# EAGLE design vc_reverb (EAGLE 7.4.0)

## Sheet 1 of 2
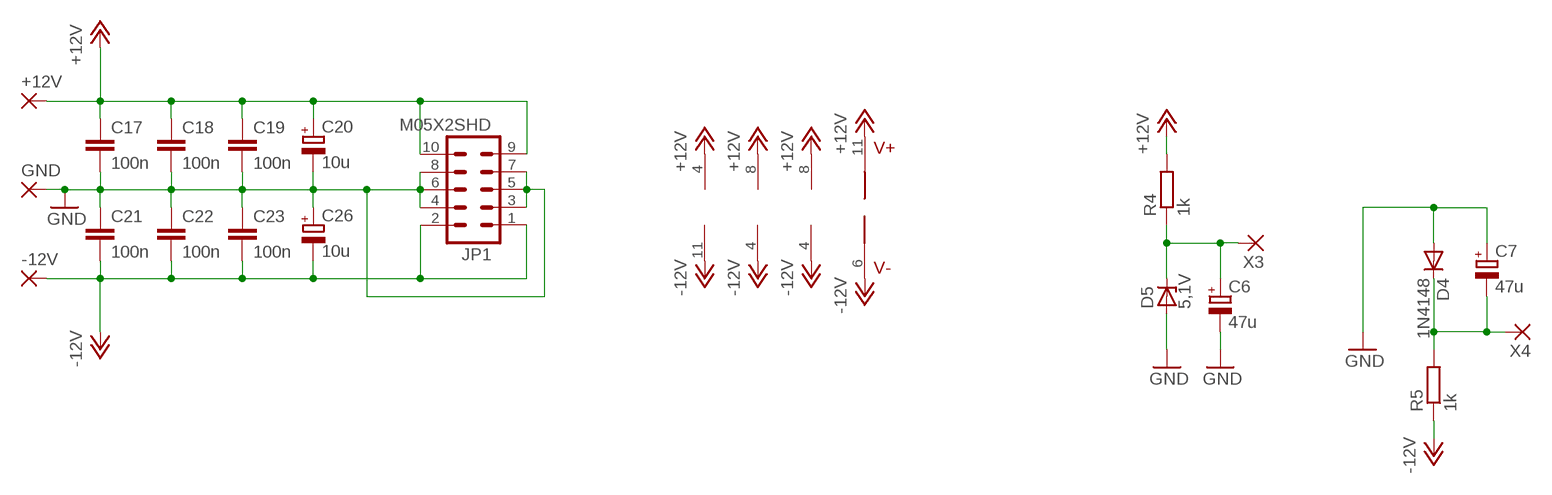
[diagram p0: schematic, sheet 1]

### Parts
+12V  2,54/1,0  [2,54/1,0]
-12V  2,54/1,0  [2,54/1,0]
C6  47u  CPOL-EUE2-5  [E2-5]
C7  47u  CPOL-EUE2-5  [E2-5]
C17  100n  C-EU025-025X050  [C025-025X050]
C18  100n  C-EU050-035X075  [C050-035X075]
C19  100n  C-EU025-025X050  [C025-025X050]
C20  10u  CPOL-EUE2-5  [E2-5]
C21  100n  C-EU025-025X050  [C025-025X050]
C22  100n  C-EU050-035X075  [C050-035X075]
C23  100n  C-EU025-025X050  [C025-025X050]
C26  10u  CPOL-EUE2-5  [E2-5]
D4  1N4148  1N4148DO35-7  [DO35-7]
D5  5,1V  ZENER-DIODEDO34-7  [DO34Z7]
GND  2,54/1,0  [2,54/1,0]
IC3  TL074P  [DIL14]
IC4  LM13700N  [DIL16]
IC5  TL072P  [DIL08]
IC6  TL072P  [DIL08]
JP1  M05X2SHD  [2X5-SHROUDED]
R4  1k  R-EU_0309/V  [0309V]
R5  1k  R-EU_0309/V  [0309V]
X3  2,54/1,0  [2,54/1,0]
X4  2,54/1,0  [2,54/1,0]

### Nets
+12V: +12V.1(P) C17.1 C18.1 C19.1 C20.+ IC3.4(P:V+) IC4.11(V+) IC5.8(P:V+) IC6.8(P:V+) JP1.9 JP1.10 R4.2 ; also sheet 2
-12V: -12V.1(P) C21.2 C22.2 C23.2 C26.- IC3.11(P:V-) IC4.6(V-) IC5.4(P:V-) IC6.4(P:V-) JP1.1 JP1.2 R5.1 ; also sheet 2
GND: C6.- C7.+ C17.2 C18.2 C19.2 C20.- C21.1 C22.1 C23.1 C26.+ D4.A D5.A GND.1(P) JP1.3 JP1.4 JP1.5 JP1.6 JP1.7 JP1.8 ; also sheet 2
N$46: C6.+ D5.C R4.1 X3.1(P)
N$47: C7.- D4.C R5.2 X4.1(P)

## Sheet 2 of 2
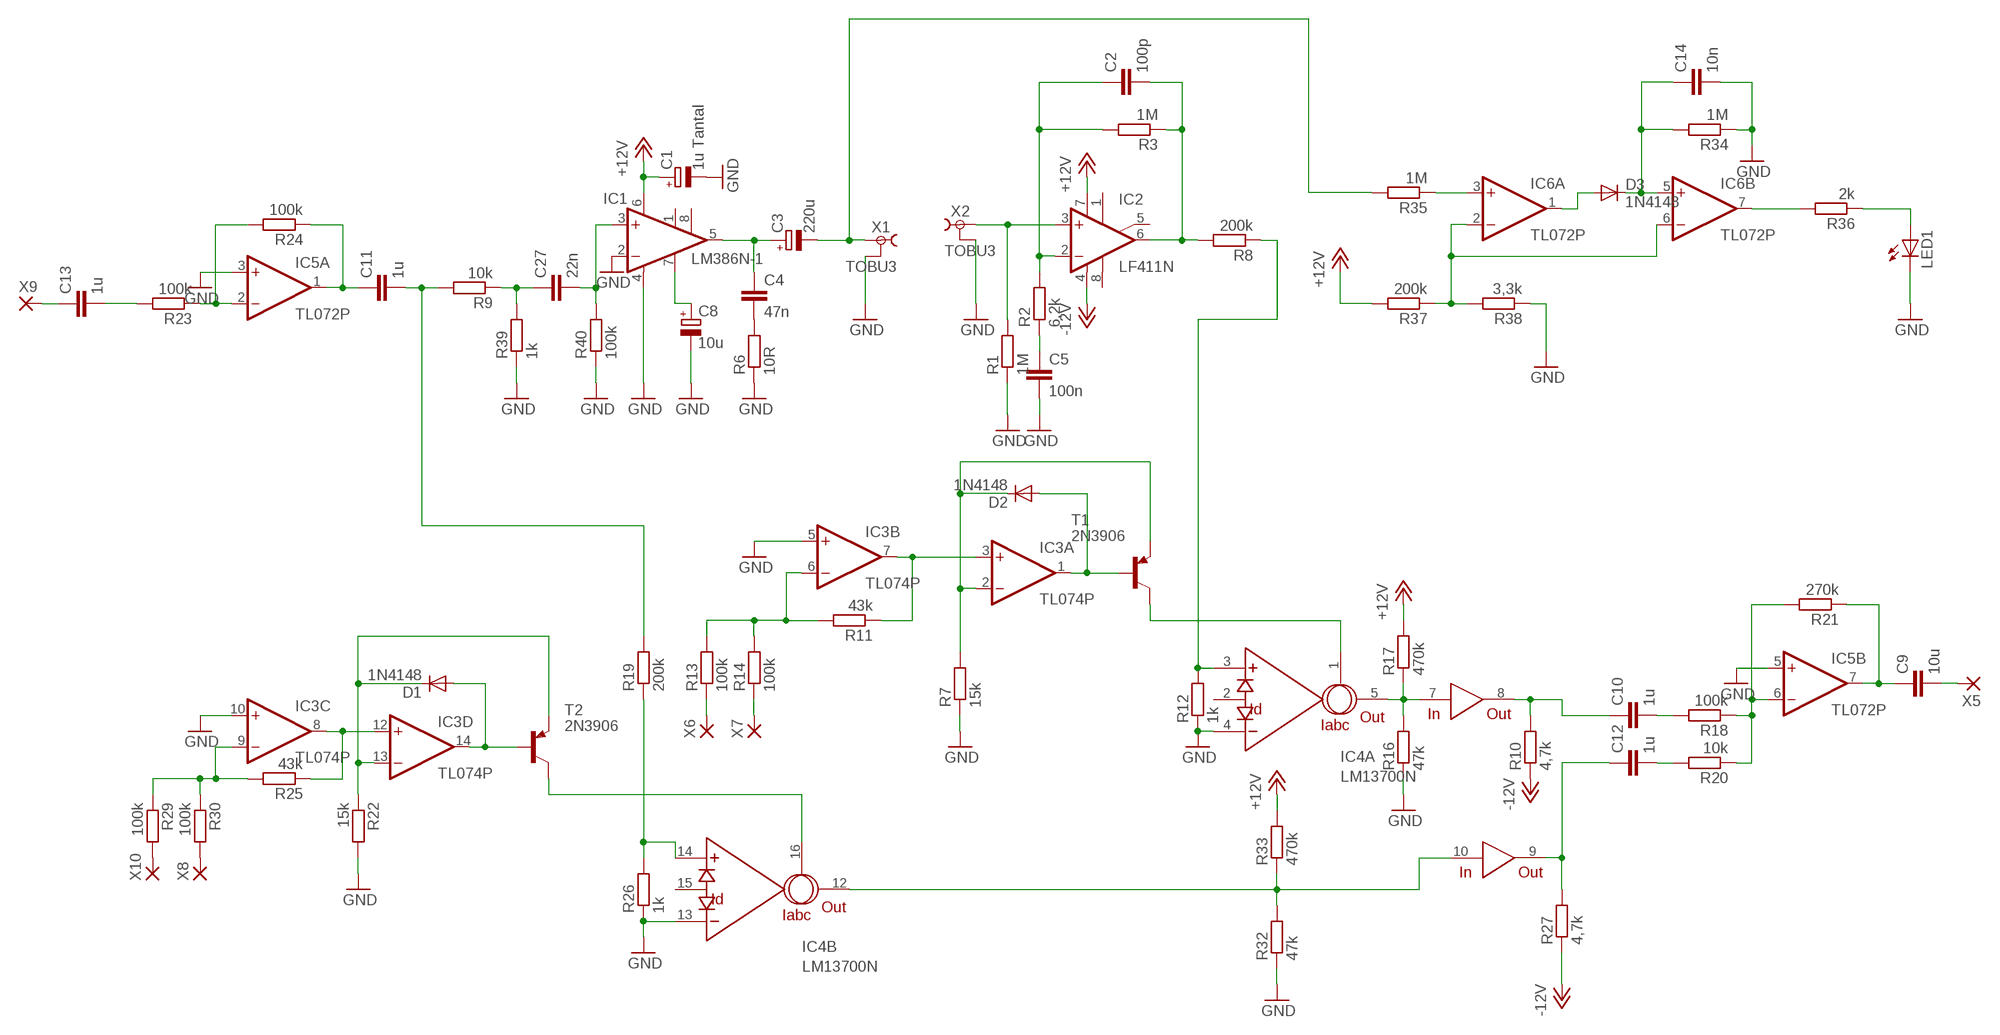
[diagram p1: schematic, sheet 2]

### Parts
C1  1u Tantal  CPOL-EUE2-5  [E2-5]
C2  100p  C-EU050-035X075  [C050-035X075]
C3  220u  CPOL-EUE3.5-8  [E3,5-8]
C4  47n  C-EU050-035X075  [C050-035X075]
C5  100n  C-EU050-035X075  [C050-035X075]
C8  10u  CPOL-EUE2-5  [E2-5]
C9  10u  C-EU050-075X075  [C050-075X075]
C10  1u  C-EU050-050X075  [C050-050X075]
C11  1u  C-EU050-050X075  [C050-050X075]
C12  1u  C-EU050-050X075  [C050-050X075]
C13  1u  C-EU050-050X075  [C050-050X075]
C14  10n  C-EU050-030X075  [C050-030X075]
C27  22n  C-EU050-035X075  [C050-035X075]
D1  1N4148  1N4148DO35-7  [DO35-7]
D2  1N4148  1N4148DO35-7  [DO35-7]
D3  1N4148  1N4148DO35-7  [DO35-7]
IC1  LM386N-1  [DIL08]
IC2  LF411N  [DIL08]
LED1  LED5MM  [LED5MM]
R1  1M  R-EU_0309/V  [0309V]
R2  6,2k  R-EU_0309/V  [0309V]
R3  1M  R-EU_0309/V  [0309V]
R6  10R  R-EU_0309/V  [0309V]
R7  15k  R-EU_0309/V  [0309V]
R8  200k  R-EU_0309/V  [0309V]
R9  10k  R-EU_0309/V  [0309V]
R10  4,7k  R-EU_0309/V  [0309V]
R11  43k  R-EU_0309/V  [0309V]
R12  1k  R-EU_0309/V  [0309V]
R13  100k  R-EU_0309/V  [0309V]
R14  100k  R-EU_0309/V  [0309V]
R16  47k  R-EU_0309/V  [0309V]
R17  470k  R-EU_0309/V  [0309V]
R18  100k  R-EU_0309/V  [0309V]
R19  200k  R-EU_0309/10  [0309/10]
R20  10k  R-EU_0309/V  [0309V]
R21  270k  R-EU_0309/V  [0309V]
R22  15k  R-EU_0309/V  [0309V]
R23  100k  R-EU_0309/V  [0309V]
R24  100k  R-EU_0309/V  [0309V]
R25  43k  R-EU_0309/V  [0309V]
R26  1k  R-EU_0309/V  [0309V]
R27  4,7k  R-EU_0309/V  [0309V]
R29  100k  R-EU_0309/V  [0309V]
R30  100k  R-EU_0309/V  [0309V]
R32  47k  R-EU_0309/V  [0309V]
R33  470k  R-EU_0309/V  [0309V]
R34  1M  R-EU_0309/V  [0309V]
R35  1M  R-EU_0309/V  [0309V]
R36  2k  R-EU_0309/V  [0309V]
R37  200k  R-EU_0309/V  [0309V]
R38  3,3k  R-EU_0309/V  [0309V]
R39  1k  R-EU_0309/V  [0309V]
R40  100k  R-EU_0309/V  [0309V]
T1  2N3906  2N3906-PNP-TO92-EBC  [TO92-EBC]
T2  2N3906  2N3906-PNP-TO92-EBC  [TO92-EBC]
X1  TOBU3  [TOBU3]
X2  TOBU3  [TOBU3]
X5  2,54/1,0  [2,54/1,0]
X6  2,54/1,0  [2,54/1,0]
X7  2,54/1,0  [2,54/1,0]
X8  2,54/1,0  [2,54/1,0]
X9  2,54/1,0  [2,54/1,0]
X10  2,54/1,0  [2,54/1,0]

### Nets
+12V: C1.+ IC1.6(VS) IC2.7(V+) R17.2 R33.2 R37.2 ; also sheet 1
-12V: IC2.4(V-) R10.1 R27.1 ; also sheet 1
GND: C1.- C5.2 C8.- C14.2 IC1.2(-IN) IC1.4(GND) IC3.5(B:+IN) IC3.10(C:+IN) IC4.4(A:-IN) IC4.13(B:-IN) IC5.3(A:+IN) IC5.5(B:+IN) LED1.K(C) R1.1 R6.1 R7.1 R12.1 R16.1 R22.2 R26.1 R32.1 R34.1 R38.1 R39.1 R40.1 X1.2 X1.2@1 X1.2@2 X2.2 X2.2@1 X2.2@2 ; also sheet 1
N$1: D3.A IC6.1(A:OUT)
N$2: C14.1 D3.C IC6.5(B:+IN) R34.2
N$3: IC6.7(B:OUT) R36.2
N$4: LED1.A R36.1
N$5: IC6.3(A:+IN) R35.1
N$6: C3.+ C4.1 IC1.5(OUT)
N$7: IC6.2(A:-IN) IC6.6(B:-IN) R37.1 R38.2
N$8: C8.+ IC1.7(BYPASS)
N$9: C4.2 R6.2
N$10: C27.2 IC1.3(+IN) R40.2
N$11: C27.1 R9.1 R39.2
N$12: IC2.3(+IN) R1.2 X2.1
N$13: C2.1 IC2.2(-IN) R2.2 R3.2
N$14: C5.1 R2.1
N$15: C2.2 IC2.6(OUT) R3.1 R8.2
N$16: IC5.2(A:-IN) R23.1 R24.2
N$17: C11.1 IC5.1(A:OUT) R24.1
N$18: C13.2 R23.2
N$19: C13.1 X9.1(P)
N$20: C11.2 R9.2 R19.2
N$21: C12.2 R20.2
N$22: C10.2 R18.2
N$23: IC5.6(B:-IN) R18.1 R20.1 R21.2
N$24: C9.1 IC5.7(B:OUT) R21.1
N$25: C9.2 X5.1(P)
N$26: C12.1 IC4.9(OUT) R27.2
N$27: C10.1 IC4.8(OUT) R10.2
N$28: IC4.5(A:OUT) IC4.7(IN) R16.2 R17.1
N$29: IC4.3(A:+IN) R8.1 R12.2
N$30: D2.A IC3.1(A:OUT) T1.B
N$31: IC4.10(IN) IC4.12(B:OUT) R32.2 R33.1
N$32: IC4.14(B:+IN) R19.1 R26.2
N$33: D2.C IC3.2(A:-IN) R7.2 T1.E
N$34: IC3.3(A:+IN) IC3.7(B:OUT) R11.1
N$35: IC3.6(B:-IN) R11.2 R13.2 R14.2
N$36: R14.1 X7.1(P)
N$37: R13.1 X6.1(P)
N$38: IC4.1(A:IABC) T1.C
N$39: D1.A IC3.14(D:OUT) T2.B
N$40: D1.C IC3.13(D:-IN) R22.1 T2.E
N$41: IC3.8(C:OUT) IC3.12(D:+IN) R25.1
N$42: IC3.9(C:-IN) R25.2 R29.1 R30.1
N$43: R30.2 X8.1(P)
N$44: R29.2 X10.1(P)
N$45: IC4.16(B:IABC) T2.C
OL: C3.- R35.2 X1.1
Unconnected: IC1.1(GAIN) IC1.8(GAIN) IC2.1(ON1) IC2.5(ON2) IC2.8(OPT) IC4.2(A:ID) IC4.15(B:ID)

## Library data of the parts
+12V -12V GND X3-X10 = wirepad:2,54/1,0: THROUGH-HOLE PAD
C1 C3 C6-C8 C20 C26 = rcl:CPOL-EU: POLARIZED CAPACITOR, European symbol
C2 C4 C5 C9-C14 C17-C19 C21-C23 C27 = rcl:C-EU: CAPACITOR, European symbol
D1-D4 = diode:1N4148: DIODE high speed (Philips)
D5 = diode:ZENER-DIODE: Z-Diode
IC1 = cavalier:LM386?-*: Low Voltage Audio Power Amplifier Source: http://cache.national.com/ds/LM/LM386.pdf
IC2 = cavalier:LF411: OP AMP
IC3 = cavalier:TL074: OP AMP
IC4 = synthdiy:LM13700: National Dual OTA with buffers.
IC5 IC6 = cavalier:TL072: OP AMP
JP1 = SparkFun:M05X2: Header 5x2 Standard 10-pin dual row 0.1" header. Commonly used with AVR-ISP. Use with Spark Fun Electronics SKU: PRT-00778
LED1 = led:LED: LED OSRAM: - CHIPLED LG R971, LG N971, LY N971, LG Q971, LY Q971, LO R971, LY R971 LH N974, LH R974 LS Q976, LO Q976, LY Q976 LO Q996 - Hyper CHIPLED LW Q18S LB Q993, LB Q99A, LB R99A - SideLED LS A670, LO A670, LY A670, LG A670, LP A670 LB A673, LV A673, LT A673, LW A673 LH A674 LY A675 LS A676, LA A676, LO A676, LY A676, LW A676 LS A679, LY A679, LG A679 - Hyper Micro SIDELED® LS Y876, LA Y876, LO Y876, LY Y876 LT Y87S - SmartLED LW L88C, LW L88S LB L89C, LB L89S, LG L890 LS L89K, LO L89K, LY L89K LS L896, LA L896, LO L896, LY L896 - TOPLED LS T670, LO T670, LY T670, LG T670, LP T670 LSG T670, LSP T670, LSY T670, LOP T670, LYG T670 LG T671, LOG T671, LSG T671 LB T673, LV T673, LT T673, LW T673 LH T674 LS T676, LA T676, LO T676, LY T676, LB T676, LH T676, LSB T676, LW T676 LB T67C, LV T67C, LT T67C, LS T67K, LO T67K, LY T67K, LW E67C LS E67B, LA E67B, LO E67B, LY E67B, LB E67C, LV E67C, LT E67C LW T67C LS T679, LY T679, LG T679 LS T770, LO T770, LY T770, LG T770, LP T770 LB T773, LV T773, LT T773, LW T773 LH T774 LS E675, LA E675, LY E675, LS T675 LS T776, LA T776, LO T776, LY T776, LB T776 LHGB T686 LT T68C, LB T68C - Hyper Mini TOPLED® LB M676 - Mini TOPLED Santana® LG M470 LS M47K, LO M47K, LY M47K Source: http://www.osram.convergy.de LUXEON: - LUMILED® LXK2-PW12-R00, LXK2-PW12-S00, LXK2-PW14-U00, LXK2-PW14-V00 LXK2-PM12-R00, LXK2-PM12-S00, LXK2-PM14-U00 LXK2-PE12-Q00, LXK2-PE12-R00, LXK2-PE12-S00, LXK2-PE14-T00, LXK2-PE14-U00 LXK2-PB12-K00, LXK2-PB12-L00, LXK2-PB12-M00, LXK2-PB14-N00, LXK2-PB14-P00, LXK2-PB14-Q00 LXK2-PR12-L00, LXK2-PR12-M00, LXK2-PR14-Q00, LXK2-PR14-R00 LXK2-PD12-Q00, LXK2-PD12-R00, LXK2-PD12-S00 LXK2-PH12-R00, LXK2-PH12-S00 LXK2-PL12-P00, LXK2-PL12-Q00, LXK2-PL12-R00 Source: www.luxeon.com KINGBRIGHT: KA-3528ASYC Source: www.kingbright.com
R1-R14 R16-R27 R29 R30 R32-R40 = rcl:R-EU_: RESISTOR, European symbol
T1 T2 = transistor-neu-to92:*-PNP-: PNP Transistror
X1 X2 = con-hirschmann:TOBU3: Female Cinch CONNECTOR ( RCA Jack ); MF: FARNELL; MPN: TOBU 3; OC_FARNELL: 592791; OC_NEWARK: 06WX5914

## Board
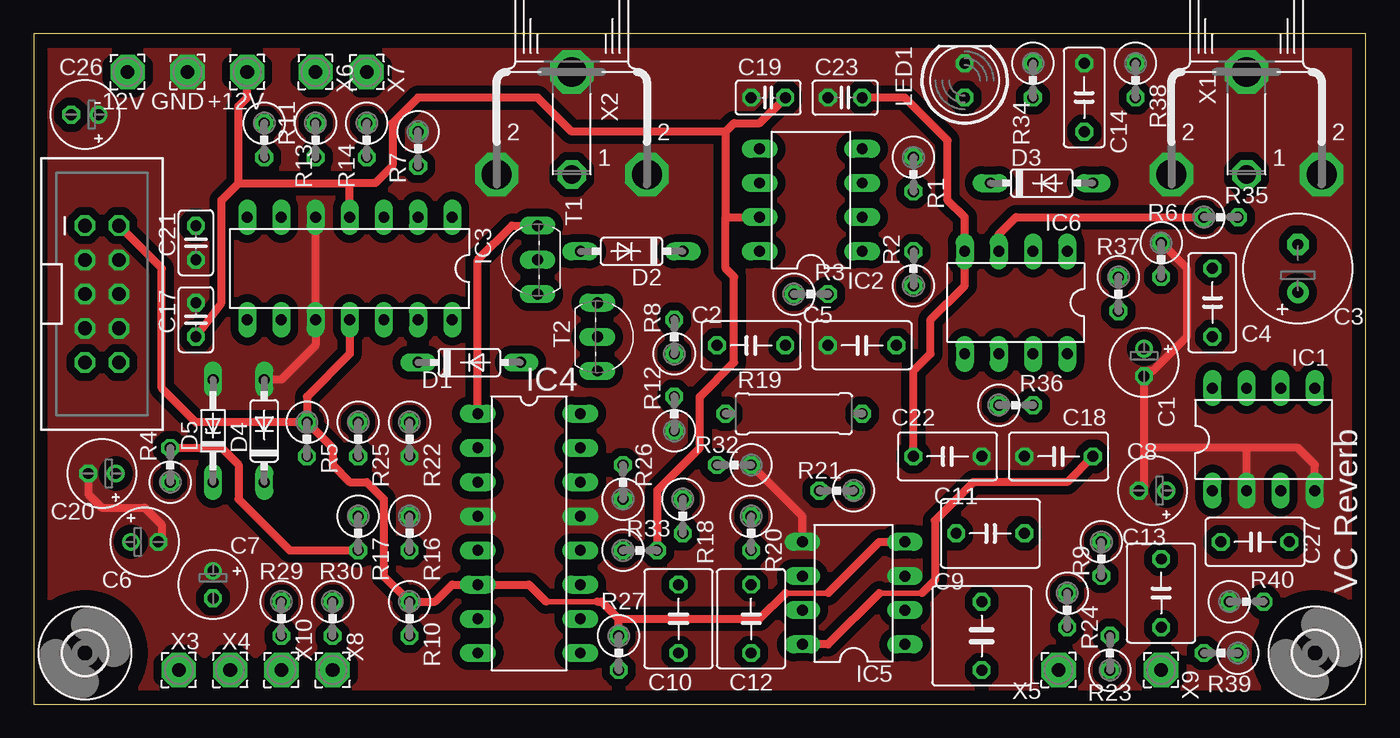
[diagram p2: board, top side]
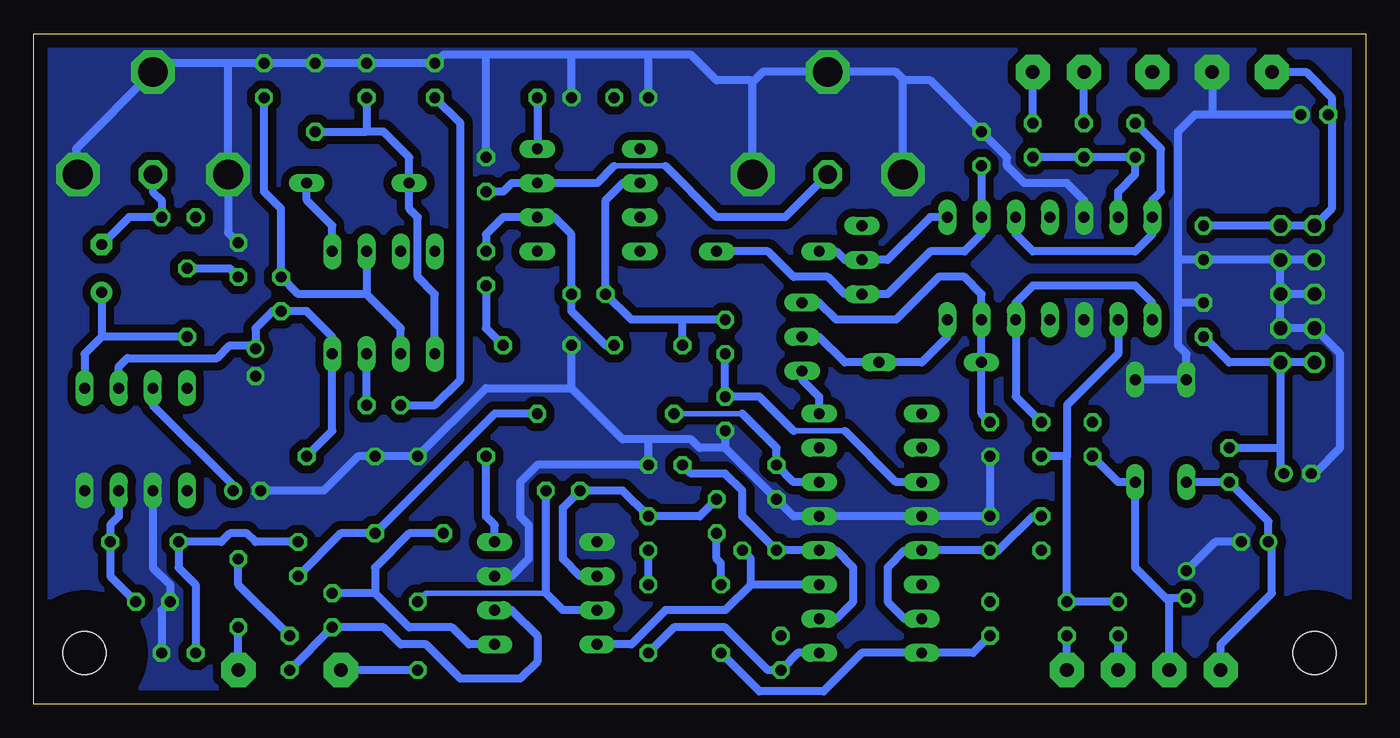
[diagram p3: board, bottom side, seen from below]

Size 99.04 x 49.84 mm. Coordinates in mm from the lower left corner, seen from the top.
Outline: 0,0 99.04,0 99.04,49.84 0,49.84 0,0
Copper layers (1*16): Top 0.035mm / dielectric 1.5mm / Bottom 0.035mm
Design rules "default": minimum track width 10mil, minimum drill 24mil, track to track 8mil, track to pad 8mil, pad to pad 8mil, via to via 8mil, smd to smd 8mil, copper to edge 40mil, drill to drill 8mil, minimum pad ring 10mil, minimum via ring 8mil, stop-mask expansion 4mil, vias tented up to drill 0mil, thermal gap 10mil

### Footprints (pad centres in the part's own frame; a part is rotated, then mirrored left to right if it is on the bottom)
2,54/1,0 = drill 1.016 pad 2.54 octagon: 1 0,0
E2-5 = drill 0.813 pad 1.27: + -1.016,0 | drill 0.813 pad 1.27 octagon: - 1.016,0
C050-035X075 = drill 0.813 octagon: 1 -2.54,0; 2 2.54,0
E3,5-8 = drill 0.813 pad 1.6: + -1.778,0 | drill 0.813 pad 1.6 octagon: - 1.778,0
C050-075X075 = drill 0.813 octagon: 1 -2.54,0; 2 2.54,0
C050-050X075 = drill 0.813 octagon: 1 -2.54,0; 2 2.54,0
C050-030X075 = drill 0.813 octagon: 1 -2.54,0; 2 2.54,0
C025-025X050 = drill 0.813 octagon: 1 -1.27,0; 2 1.27,0
DO35-7 = drill 0.813 long: A 3.81,0; C -3.81,0
DO34Z7 = drill 0.813 long: A 3.81,0; C -3.81,0
DIL08 = drill 0.813 pad 1.27 long: 1 -3.81,-3.81; 2 -1.27,-3.81; 3 1.27,-3.81; 4 3.81,-3.81; 5 3.81,3.81; 6 1.27,3.81; 7 -1.27,3.81; 8 -3.81,3.81
DIL14 = drill 0.813 long: 1 -7.62,-3.81; 2 -5.08,-3.81; 3 -2.54,-3.81; 4 0,-3.81; 5 2.54,-3.81; 6 5.08,-3.81; 7 7.62,-3.81; 8 7.62,3.81; 9 5.08,3.81; 10 2.54,3.81; 11 0,3.81; 12 -2.54,3.81; 13 -5.08,3.81; 14 -7.62,3.81
DIL16 = drill 0.813 long: 1 -8.89,-3.81; 2 -6.35,-3.81; 3 -3.81,-3.81; 4 -1.27,-3.81; 5 1.27,-3.81; 6 3.81,-3.81; 7 6.35,-3.81; 8 8.89,-3.81; 9 8.89,3.81; 10 6.35,3.81; 11 3.81,3.81; 12 1.27,3.81; 13 -1.27,3.81; 14 -3.81,3.81; 15 -6.35,3.81; 16 -8.89,3.81
2X5-SHROUDED = drill 1.016 octagon: 1 -1.27,5.08; 2 1.27,5.08; 3 -1.27,2.54; 4 1.27,2.54; 5 -1.27,0; 6 1.27,0; 7 -1.27,-2.54; 8 1.27,-2.54; 9 -1.27,-5.08; 10 1.27,-5.08
LED5MM = drill 0.813 octagon: A -1.27,0; K 1.27,0
0309V = drill 0.813 octagon: 1 -1.27,0; 2 1.27,0
0309/10 = drill 0.813 octagon: 1 -5.08,0; 2 5.08,0
TO92-EBC = drill 0.813 long: B 0,-1.27; C 2.54,-1.27; E -2.54,-1.27
3,2 = hole 3.2: 0,0
TOBU3 = drill 1.397 octagon: 1 0,-2.54 | drill 2.21 octagon: 2 5.588,-2.54; 2@1 -5.588,-2.54; 2@2 0,5.08

### Placement (x,y rotation side)
+12V  15.88,46.99 90 top
-12V  6.99,46.99 90 top
C1  82.55,25.4 270 top
C2  53.34,26.67 180 top
C3  93.98,32.38 90 top
C4  87.63,29.84 90 top
C5  61.59,26.67 180 top
C6  8.26,12.06 0 top
C7  13.34,8.89 270 top
C8  83.19,15.88 180 top
C9  70.48,5.08 270 top
C10  47.94,6.35 90 top
C11  71.12,12.7 0 top
C12  53.34,6.35 90 top
C13  83.82,8.26 90 top
C14  78.11,45.09 90 top
C17  12.06,28.57 90 top
C18  76.2,18.41 180 top
C19  54.61,45.09 180 top
C20  5.08,17.14 180 top
C21  12.06,34.29 90 top
C22  67.94,18.41 180 top
C23  60.33,45.09 0 top
C26  3.81,43.81 180 top
C27  90.81,12.06 0 top
D1  32.38,25.4 0 top
D2  44.45,33.66 180 top
D3  74.93,38.73 0 top
D4  17.14,20.32 90 top
D5  13.34,20.32 90 top
GND  11.43,46.99 90 top
IC1  91.44,19.68 0 top
IC2  57.78,37.47 90 top
IC3  23.5,32.38 180 top
IC4  36.83,12.7 270 top
IC5  60.96,8.26 90 top
IC6  73.03,29.84 180 top
JP1  5.08,30.48 0 top
LED1  69.22,46.35 90 top
R1  65.41,39.37 270 top
R2  65.41,32.38 90 top
R3  57.78,30.48 0 top
R4  10.16,17.78 90 top
R5  20.32,19.68 270 top
R6  83.82,33.02 270 top
R7  28.57,41.27 270 top
R8  47.62,27.3 90 top
R9  79.38,10.79 270 top
R10  27.94,6.35 270 top
R11  17.14,41.91 270 top
R12  47.62,21.59 90 top
R13  20.95,41.91 270 top
R14  24.77,41.91 270 top
R16  27.94,12.7 270 top
R17  24.13,12.7 270 top
R18  48.26,13.97 270 top
R19  56.52,21.59 0 top
R20  53.34,12.7 270 top
R21  59.69,15.88 180 top
R22  27.94,19.68 270 top
R23  80.01,3.81 90 top
R24  76.83,6.99 270 top
R25  24.13,19.68 270 top
R26  43.81,16.51 90 top
R27  43.5,3.81 270 top
R29  18.41,6.35 270 top
R30  22.23,6.35 270 top
R32  52.07,17.78 180 top
R33  45.09,11.43 0 top
R34  74.3,46.35 270 top
R35  88.27,36.2 0 top
R36  73.03,22.23 0 top
R37  80.64,30.48 270 top
R38  81.92,46.35 270 top
R39  88.27,3.81 180 top
R40  90.17,7.62 0 top
T1  36.2,33.02 90 top
T2  43.18,27.3 270 top
U$1  [3,2]  3.81,3.81 0 top
U$2  [3,2]  95.25,3.81 0 top
X1  90.17,41.91 0 top
X2  40.01,41.91 0 top
X3  10.79,2.54 90 top
X4  14.61,2.54 90 top
X5  76.2,2.54 90 top
X6  20.95,46.99 90 top
X7  24.77,46.99 90 top
X8  22.23,2.54 90 top
X9  83.82,2.54 90 top
X10  18.41,2.54 90 top

### Tracks (layer width: path | path; a pad name or v marks a point on that pad's centre or on a via)
+12V
  Top 0.406: 62.87,8.26 66.04,8.26
  Top 0.61: IC3.4 23.5,38.73 | 51.44,42.55 40.01,42.55 37.47,45.09 28.57,45.09 26.67,43.18 26.67,40.01 25.4,38.73 23.5,38.73 | 51.44,42.55 51.44,36.2 | 51.44,36.2 IC2.7 | 51.44,36.2 51.44,32.38 52.07,31.75 52.07,25.4 49.53,22.86 49.53,19.05 46.35,15.88 R33.2 | R4.2 13.97,19.05 15.24,17.78 15.24,15.24 19.05,11.43 R17.2 | C18.1 76.83,16.51 69.85,16.51 66.99,13.65 66.99,9.21 66.04,8.26 | 62.87,8.26 59.05,4.45 IC5.8 | 15.24,38.73 23.5,38.73 | 15.24,38.73 15.24,44.45 15.88,45.09 +12V.1 | C17.1 13.97,29.84 13.97,37.47 15.24,38.73 | 51.44,42.55 52.07,43.18 53.98,43.18 C19.1
  Bottom 0.61: JP1.9 JP1.10 | JP1.10 6.35,19.05 | 6.35,19.05 6.35,17.4 C20.+ | R4.2 6.35,19.05 | IC1.6 92.71,25.08 92.08,25.72 85.41,25.72 84.45,26.67 82.8,26.67 C1.+ 82.55,27.94 81.28,29.21 R37.2 78.74,29.21 76.83,27.3 IC6.8 76.83,20.32 C18.1 | IC5.8 54.61,4.45 52.07,6.99 47.62,6.99 45.72,8.89 | JP1.10 10.16,25.4 C17.1 | IC4.11 45.72,8.89 | 45.72,8.89 45.72,10.79 R33.2
-12V
  Top 0.406: 38.1,7.62 41.91,7.62 | 55.88,8.26 59.05,8.26
  Top 0.61: C22.2 65.41,24.77 66.67,26.04 66.67,28.57 69.22,31.11 IC6.4 69.22,36.2 67.94,37.47 67.94,41.91 64.77,45.09 C23.2 | IC3.11 23.5,26.04 20.32,22.86 R5.1 | R5.1 22.23,19.05 22.23,17.78 23.5,16.51 24.77,16.51 26.04,15.24 26.04,9.53 R10.1 29.84,7.62 31.11,8.89 IC4.6 36.83,8.89 38.1,7.62 | 55.88,8.26 53.98,6.35 43.5,6.35 | 59.05,8.26 62.87,12.06 IC5.4 | R5.1 12.06,20.95 9.53,23.5 9.53,32.38 JP1.2 | 41.91,7.62 42.23,7.62 43.5,6.35 | R27.1 43.5,6.35
  Bottom 0.61: 2.54,44.07 2.54,45.09 4.45,46.99 -12V.1 | 2.54,44.07 C26.- | IC5.4 64.77,13.34 65.41,13.97 C22.2 | C23.2 IC2.4 | 2.54,44.07 2.54,36.83 JP1.1 JP1.2 C21.2
GND
  Top 0.61: C20.- 4.06,15.62 5.08,14.61 8.26,14.61 9.53,13.34 9.53,12.32 C6.- | D4.A 18.41,24.13 20.95,26.67 IC3.10 IC3.5 | IC5.5 57.15,13.97 R32.1 | R6.1 85.72,32.38 85.72,27.3 83.19,24.77 82.8,24.77 C1.- 82.55,19.05 | 82.55,19.05 82.55,16.13 C8.- | IC1.2 90.17,19.05 | 90.17,19.05 82.55,19.05 | IC1.4 95.25,17.78 93.98,19.05 90.17,19.05
  Bottom 0.61: C20.- 3.81,17.14 1.91,19.05 1.91,26.04 JP1.7 JP1.8 JP1.6 | JP1.5 JP1.6 | JP1.3 JP1.4 | JP1.6 JP1.4 | 47.62,19.05 R26.1 42.55,13.97 IC4.13 IC4.4 R16.1 R22.2 | R12.1 47.62,19.05 | 47.62,19.05 49.53,19.05 50.16,19.68 53.34,19.68 | D4.A D5.A 13.34,26.04 13.97,26.67 13.97,29.84 | C26.+ 11.43,43.81 | 11.43,43.81 12.7,43.81 13.97,42.55 13.97,33.02 | GND.1 11.43,43.81 | C6.- 11.18,12.06 C7.+ | IC3.5 20.95,37.47 22.23,38.73 25.4,38.73 26.67,40.01 26.67,40.64 R7.1 32.38,46.35 34.42,46.35 | 65.41,48.26 68.58,48.26 LED1.K R34.1 C14.2 R38.1 84.45,47.62 | 84.45,47.62 89.53,47.62 X1.2@2 95.89,41.27 95.89,39.5 X1.2 | 84.45,47.62 84.58,47.5 X1.2@1 84.58,35.05 R6.1 | 53.34,19.68 55.24,19.68 59.05,23.5 | 59.05,23.5 C5.2 | 53.34,19.68 R32.1 61.59,17.78 62.87,16.51 62.87,13.97 62.23,13.34 62.23,10.79 63.5,9.53 IC5.3 | X2.2 45.59,46.23 44.83,46.99 X2.2@2 34.92,46.99 34.42,46.48 34.42,46.35 | R1.1 65.41,48.26 | C8.- 77.47,15.88 74.93,18.41 C18.2 C22.1 65.41,23.5 59.05,23.5 | X2.2@1 34.42,46.35 | IC1.2 90.17,10.16 88.9,8.89 R40.1 89.53,6.99 R39.1 | 13.97,33.02 13.97,29.84 | C17.2 13.97,29.84 | 13.97,33.02 C21.1 JP1.4 | 45.72,46.35 48.26,46.35 50.16,48.26 53.34,48.26 | 53.34,48.26 59.05,48.26 | 59.05,48.26 65.41,48.26 | C23.1 59.05,48.26 | C19.2 53.34,48.26
  pour Bottom (isolate 0.61, no thermals): 0,49.53 0,0 99.06,0 99.06,49.53
  pour Top (isolate 0.61, no thermals): 0.64,48.9 0.64,0.64 98.42,0.64 98.42,48.9
N$1
  Bottom 0.61: IC6.1 76.83,35.56 78.74,37.47 D3.A
N$2
  Bottom 0.61: R34.2 74.3,42.55 | C14.1 74.3,42.55 | IC6.5 69.22,30.48 70.48,31.75 70.48,36.2 71.12,36.83 D3.C 71.12,40.64 73.03,42.55 74.3,42.55
N$3
  Bottom 0.61: R36.2 IC6.7
N$4
  Bottom 0.61: R36.1 69.22,22.23 67.31,24.13 67.31,43.18 LED1.A
N$5
  Top 0.61: IC6.3 71.75,34.92 73.03,36.2 R35.1
N$6
  Bottom 0.61: C4.1 93.98,27.3 | IC1.5 95.25,26.04 94.3,26.99 93.98,27.3 | C3.+ 93.98,27.3
N$7
  Bottom 0.61: IC6.6 71.75,27.94 74.3,30.48 | IC6.2 74.3,30.48 | 74.3,30.48 79.38,30.48 R37.1 80.64,36.83 81.92,38.1 R38.2
N$8
  Bottom 0.61: C8.+ 84.2,16.26 90.17,22.23 IC1.7
N$9
  Bottom 0.61: C4.2 84.45,32.38 R6.2
N$10
  Bottom 0.61: IC1.3 92.71,13.97 93.34,13.34 C27.2 93.34,9.53 R40.2
N$11
  Bottom 0.61: R39.2 87,8.89 88.27,10.16 C27.1 85.09,12.06 84.45,12.7 83.19,12.7 82.55,12.06 R9.1
N$12
  Bottom 0.406: 52.07,40.01 55.88,40.01
  Bottom 0.61: X2.1 43.18,36.2 48.26,36.2 52.07,40.01 | 55.88,40.01 57.15,38.73 IC2.3 63.5,38.73 64.14,38.1 R1.2
N$13
  Bottom 0.61: C2.1 56.52,26.67 59.05,29.21 R3.2 59.05,34.92 60.33,36.2 IC2.2 64.14,36.2 65.41,34.92 R2.2
N$14
  Bottom 0.61: R2.1 65.41,27.94 C5.1
N$15
  Bottom 0.61: R8.2 50.8,28.57 | 50.8,28.57 54.61,28.57 R3.1 56.52,37.47 55.24,38.73 IC2.6 | C2.2 50.8,28.57
N$16
  Bottom 0.61: IC5.2 63.5,6.99 61.59,5.08 61.59,3.17 62.87,1.91 67.31,1.91 69.85,4.45 71.75,4.45 73.03,5.71 R24.2 R23.1
N$17
  Bottom 0.61: IC5.1 66.67,4.45 67.94,5.71 71.12,5.71 73.66,8.26 | 73.66,8.26 R24.1 | C11.1 71.12,12.7 73.66,10.16 73.66,8.26
N$18
  Bottom 0.61: R23.2 83.82,8.89 C13.2
N$19
  Bottom 0.61: X9.1 C13.1
N$20
  Bottom 0.61: R19.2 64.77,21.59 C11.2 76.2,12.7 R9.2
N$21
  Bottom 0.61: C12.2 R20.2
N$22
  Bottom 0.61: C10.2 47.94,10.48 48.26,10.79 R18.2
N$23
  Bottom 0.61: IC5.6 58.42,9.53 59.69,10.79 59.69,14.61 R21.2 55.24,15.88 R20.1 49.53,13.97 R18.1
N$24
  Bottom 0.406: 60.96,8.26 69.85,8.26 C9.1
  Bottom 0.61: IC5.7 59.69,6.99 60.96,8.26 R21.1
N$25
  Bottom 0.61: C9.2 X5.1
N$26
  Bottom 0.61: IC4.9 42.23,3.81 R27.2 44.45,2.54 47.62,5.71 51.44,5.71 C12.1
N$27
  Bottom 0.61: R10.2 29.21,3.81 IC4.8 37.47,3.81 40.32,0.95 45.09,0.95 C10.1
N$28
  Bottom 0.61: IC4.7 34.29,6.35 35.56,7.62 35.56,10.16 34.29,11.43 IC4.5 R16.2 27.3,11.43 24.77,13.97 R17.1
N$29
  Bottom 0.406: 38.73,20.32 42.55,20.32
  Bottom 0.61: IC4.3 34.92,16.51 38.73,20.32 | 42.55,20.32 45.09,22.86 R12.2 R8.1
N$30
  Bottom 0.61: IC3.1 32.38,36.2 35.56,33.02 T1.B 38.73,33.02 39.37,33.66 D2.A
N$31
  Bottom 0.61: IC4.10 39.37,6.35 38.1,7.62 38.1,10.16 39.37,11.43 IC4.12 R33.1 46.35,13.97 46.35,15.88 47.62,17.14 50.16,17.14 R32.2
N$32
  Bottom 0.406: 46.35,21.59 R19.1
  Bottom 0.61: IC4.14 42.55,16.51 R26.2 43.81,19.05 46.35,21.59
N$33
  Bottom 0.61: R7.2 IC3.2 28.57,34.92 29.84,33.66 32.38,33.66 35.56,30.48 T1.E 38.73,30.48 40.01,31.75 42.55,31.75 44.45,33.66 D2.C
N$34
  Bottom 0.61: IC3.3 26.04,34.92 24.77,33.66 17.14,33.66 15.88,34.92 IC3.7 15.88,37.47 15.24,38.1 15.24,41.27 R11.1
N$35
  Bottom 0.61: R14.2 R13.2 R11.2 17.14,39.37 18.41,38.1 IC3.6
N$36
  Bottom 0.61: R14.1 X7.1
N$37
  Bottom 0.61: R13.1 X6.1
N$38
  Top 0.61: IC4.1 33.02,33.02 35.56,35.56 T1.C
N$39
  Bottom 0.61: IC3.14 31.11,27.3 33.02,25.4 D1.A 38.73,25.4 40.64,27.3 T2.B
N$40
  Bottom 0.61: R22.1 28.57,21.59 D1.C IC3.13 28.57,30.48 29.84,31.75 31.75,31.75 34.92,28.57 39.37,28.57 40.64,29.84 T2.E
N$41
  Bottom 0.61: IC3.8 15.88,29.84 17.14,31.11 24.77,31.11 26.04,29.84 IC3.12 26.04,22.86 R25.1
N$42
  Bottom 0.61: R29.1 R30.1 22.23,18.41 | 22.23,18.41 R25.2 | IC3.9 18.41,26.04 22.23,22.23 22.23,18.41
N$43
  Bottom 0.61: X8.1 R30.2
N$44
  Bottom 0.61: X10.1 R29.2
N$45
  Bottom 0.61: T2.C 41.91,24.13 40.64,22.86 IC4.16
N$46
  Bottom 0.61: X3.1 10.79,4.45 6.99,8.26 6.99,11.81 C6.+ 7.24,13.59 R4.1 D5.C
N$47
  Bottom 0.61: X4.1 14.61,7.62 | 14.61,7.62 17.14,10.16 D4.C 18.41,16.51 R5.2 | C7.- 14.67,7.87 14.61,7.62
OL
  Bottom 0.61: C3.- 91.95,36.2 R35.2 89.53,37.47 90.17,38.1 X1.1

### Text on the board
tPlace: VC Reverb